# EAGLE design Assam_police (EAGLE 7.2.0)
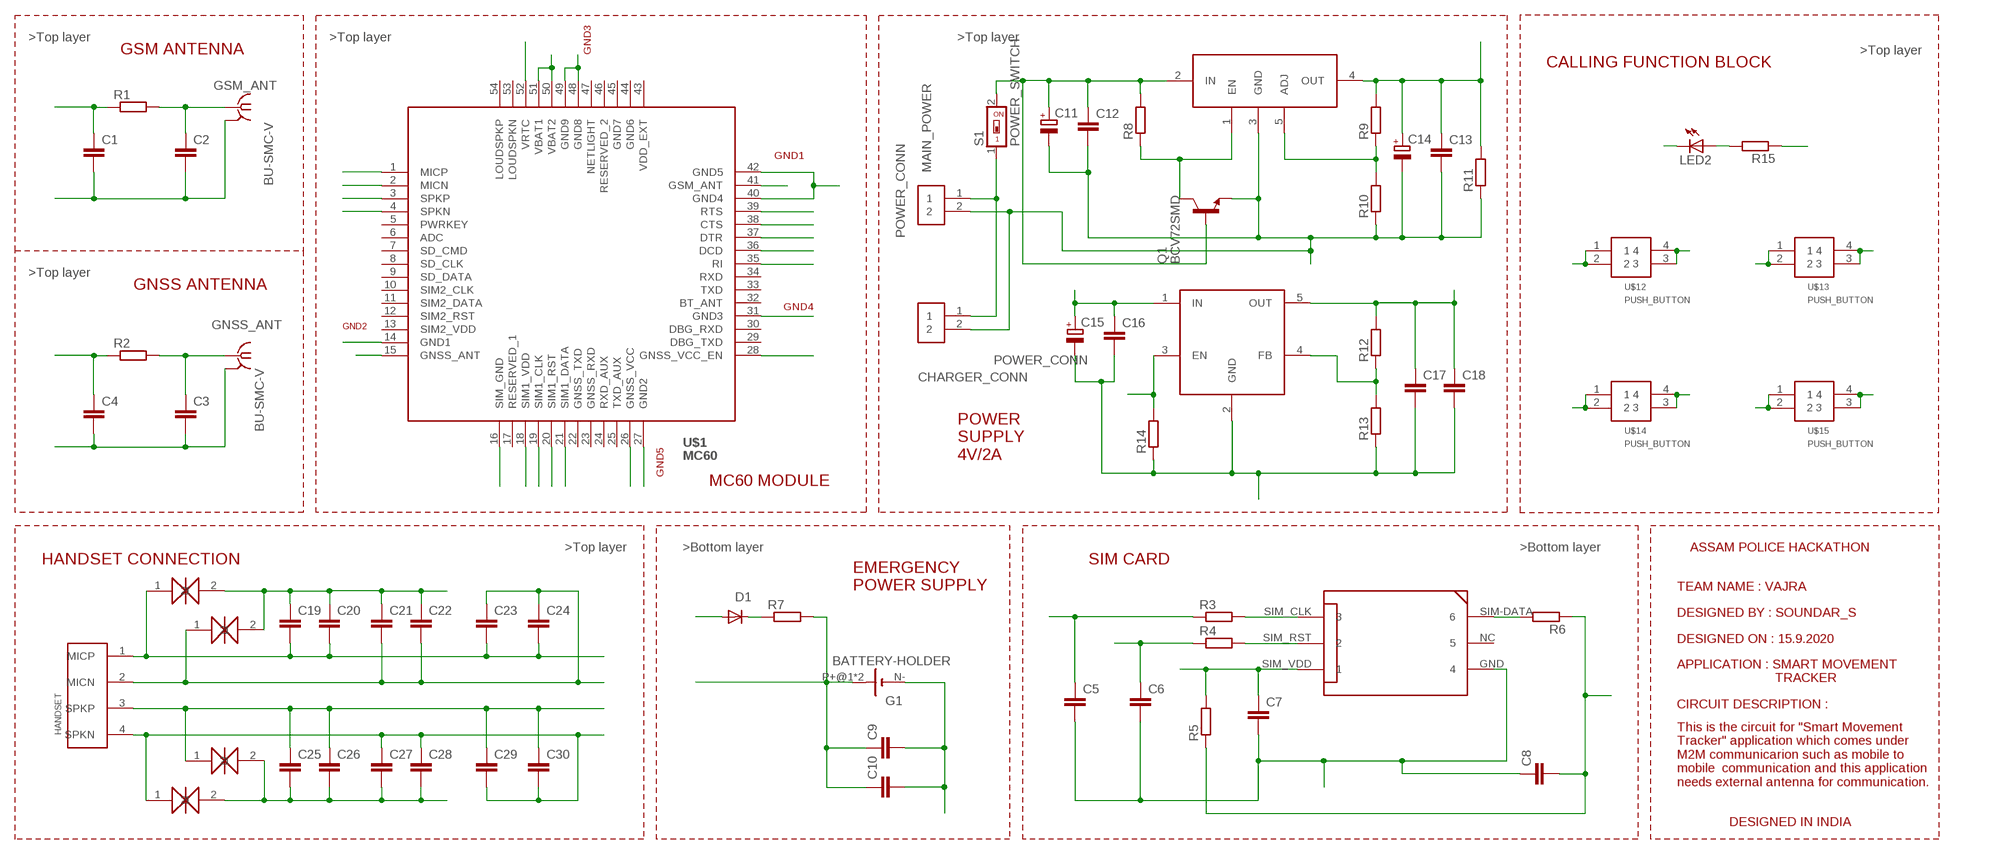
[diagram p0: schematic, sheet 1]

## Parts
C1  C-EUC0603K  [C0603K]
C2  C-EUC0603K  [C0603K]
C3  C-EUC0603K  [C0603K]
C4  C-EUC0603K  [C0603K]
C5  C-EUC0603K  [C0603K]
C6  C-EUC0603K  [C0603K]
C7  C-EUC0603K  [C0603K]
C8  C-EUC0603K  [C0603K]
C9  C-EUC0603K  [C0603K]
C10  C-EUC0603K  [C0603K]
C11  CPOL-EU140CLH-0810  [140CLH-0810]
C12  C-EUC1808  [C1808]
C13  C-EUC1808  [C1808]
C14  CPOL-EU140CLH-0810  [140CLH-0810]
C15  CPOL-EU140CLH-0810  [140CLH-0810]
C16  C-EUC1808  [C1808]
C17  C-EUC1808  [C1808]
C18  C-EUC1808  [C1808]
C19  C-EUC0603K  [C0603K]
C20  C-EUC0603K  [C0603K]
C21  C-EUC0603K  [C0603K]
C22  C-EUC0603K  [C0603K]
C23  C-EUC0603K  [C0603K]
C24  C-EUC0603K  [C0603K]
C25  C-EUC0603K  [C0603K]
C26  C-EUC0603K  [C0603K]
C27  C-EUC0603K  [C0603K]
C28  C-EUC0603K  [C0603K]
C29  C-EUC0603K  [C0603K]
C30  C-EUC0603K  [C0603K]
CHARGER_CONN  POWER_CONN  POWER_PUSH_TYPE_CONN  [POWER_PUSH_TYPE]
D1  CGRM4001-G  [SOD-123_MINI-SMA]
G1  BATTERY-HOLDER  BATTERY-HOLDER_11.6MM  [CELL_RETAINER_11.6MM]
GNSS_ANT  BU-SMC-V  [BU-SMC-V]
GSM_ANT  BU-SMC-V  [BU-SMC-V]
LED2  LEDSMT1206  [1206]
MAIN_POWER  POWER_CONN  POWER_PUSH_TYPE_CONN  [POWER_PUSH_TYPE]
Q1  BCV72SMD  [SOT23-BEC]
R1  R-EU_M3516  [M3516]
R2  R-EU_M3516  [M3516]
R3  R-EU_M3516  [M3516]
R4  R-EU_M3516  [M3516]
R5  R-EU_M3516  [M3516]
R6  R-EU_M3516  [M3516]
R7  R-EU_M3516  [M3516]
R8  R-EU_MELF0207W  [MINI_MELF-0207W]
R9  R-EU_MELF0207W  [MINI_MELF-0207W]
R10  R-EU_MELF0207W  [MINI_MELF-0207W]
R11  R-EU_MELF0207W  [MINI_MELF-0207W]
R12  R-EU_MELF0207W  [MINI_MELF-0207W]
R13  R-EU_MELF0207W  [MINI_MELF-0207W]
R14  R-EU_MELF0207W  [MINI_MELF-0207W]
R15  R-EU_M3516  [M3516]
S1  POWER_SWITCH  SWS001  [SMS-001]
U$1  MC60  [MC60]
U$2  SIM_MODULE  SIM_6_SMD  [SIM_6_SMD]
U$3  MIC29302  [TO-252]
U$4  SGM2019  [SGM2019]
U$5  HANDSET  HANDSET_4_PIN  [HANDSET_4]
U$6  ESD_DIODE  ESD_PRO_DIODE_1  [ESD_PROTECTION_DIODE]
U$7  ESD_DIODE  ESD_PRO_DIODE_1  [ESD_PROTECTION_DIODE]
U$8  ESD_DIODE  ESD_PRO_DIODE_1  [ESD_PROTECTION_DIODE]
U$9  ESD_DIODE  ESD_PRO_DIODE_1  [ESD_PROTECTION_DIODE]
U$12  PUSH_BUTTON  PUSH_BUTTON_4  [PUSH_BUTTON]
U$13  PUSH_BUTTON  PUSH_BUTTON_4  [PUSH_BUTTON]
U$14  PUSH_BUTTON  PUSH_BUTTON_4  [PUSH_BUTTON]
U$15  PUSH_BUTTON  PUSH_BUTTON_4  [PUSH_BUTTON]

## Nets
CALL_CUT0: U$1.37(DTR) U$13.1 U$13.2
CALL_CUT1: U$1.35(RI) U$15.1 U$15.2
CALL_MAKING: U$1.36(DCD) U$14.1 U$14.2
CALL_PICKING: U$1.38(CTS) U$12.1 U$12.2
GND1: C1.2 C2.2 GSM_ANT.2 GSM_ANT.3 GSM_ANT.4 GSM_ANT.5 LED2.C U$1.40(GND4) U$1.42(GND5)
GND2: C3.2 C4.2 C19.1 C20.1 C21.1 C22.1 C25.2 C26.2 C27.2 C28.2 GNSS_ANT.2 GNSS_ANT.3 GNSS_ANT.4 GNSS_ANT.5 U$1.14(GND1) U$6.2 U$7.2 U$8.2 U$9.2
GND3: C9.2 C10.2 C11.- C12.2 C13.2 C14.- CHARGER_CONN.2 G1.N-(-) MAIN_POWER.2 Q1.E R10.1 R11.1 U$1.48(GND8) U$1.49(GND9) U$3.3(GND)
GND4: U$1.31(GND3)
GND5: C15.- C16.2 C17.2 C18.2 R13.1 R14.1 U$1.27(GND2) U$4.2(GND)
GNSS_ANT: C4.1 R2.1 U$1.15(GNSS_ANT)
GNSS_VCC: C17.1 C18.1 R12.2 U$1.26(GNSS_VCC) U$4.5(OUT)
GNSS_VCC_EN: R14.2 U$1.28(GNSS_VCC_EN) U$4.3(EN)
GSM_ANT: C1.1 R1.1 U$1.41(GSM_ANT)
INCOMMING_CALL_INDI: R15.1 U$1.39(RTS)
MICN: C21.2 C22.2 C23.1 C24.1 U$1.2(MICN) U$5.2(MICN) U$7.1
MICP: C19.2 C20.2 C23.2 C24.2 U$1.1(MICP) U$5.1(MICP) U$6.1
N$1: C2.1 GSM_ANT.1 R1.2
N$2: R3.2 U$2.SIM_CLK
N$3: R4.2 U$2.SIM_RST
N$5: C3.1 GNSS_ANT.1 R2.2
N$6: CHARGER_CONN.1 MAIN_POWER.1 S1.1
N$7: D1.C R7.1
N$8: LED2.A R15.2
N$9: R6.2 U$2.SIM-DATA
N$11: R9.1 R10.2 U$3.5(ADJ)
N$12: R12.1 R13.2 U$4.4(FB)
N$17: C11.+ C12.1 Q1.B R8.2 S1.2 U$3.2(IN)
N$21: Q1.C R8.1 U$3.1(EN)
SIM_CLK: C5.1 R3.1 U$1.19(SIM1_CLK)
SIM_DATA: C8.2 R5.1 R6.1 U$1.21(SIM1_DATA)
SIM_GND: C5.2 C6.2 C7.2 C8.1 U$1.16(SIM_GND) U$2.GND
SIM_RST: C6.1 R4.1 U$1.20(SIM1_RST)
SIM_VDD: C7.1 R5.2 U$1.18(SIM1_VDD) U$2.SIM_VDD
SPKN: C27.1 C28.1 C29.2 C30.2 U$1.4(SPKN) U$5.4(SPKN) U$9.1
SPKP: C25.1 C26.1 C29.1 C30.1 U$1.3(SPKP) U$5.3(SPKP) U$8.1
VBAT: C13.1 C14.+ C15.+ C16.1 D1.A R9.2 R11.2 U$1.50(VBAT2) U$1.51(VBAT1) U$3.4(OUT) U$4.1(IN) U$12.3 U$12.4 U$13.3 U$13.4 U$14.3 U$14.4 U$15.3 U$15.4
VRTC: C9.1 C10.1 G1.P+@1(+) G1.P+@2(+) R7.2 U$1.52(VRTC)
Unconnected: U$1.5(PWRKEY) U$1.6(ADC) U$1.7(SD_CMD) U$1.8(SD_CLK) U$1.9(SD_DATA) U$1.10(SIM2_CLK) U$1.11(SIM2_DATA) U$1.12(SIM2_RST) U$1.13(SIM2_VDD) U$1.17(RESERVED_1) U$1.22(GNSS_TXD) U$1.23(GNSS_RXD) U$1.24(RXD_AUX) U$1.25(TXD_AUX) U$1.29(DBG_TXD) U$1.30(DBG_RXD) U$1.32(BT_ANT) U$1.33(TXD) U$1.34(RXD) U$1.43(VDD_EXT) U$1.44(GND6) U$1.45(GND7) U$1.46(RESERVED_2) U$1.47(NETLIGHT) U$1.53(LOUDSPKN) U$1.54(LOUDSPKP) U$2.NC

## Notes on the sheet
- >Top layer | >Top layer | >Top layer
- GSM ANTENNA | GND3 | >Top layer
- CALLING FUNCTION BLOCK
- GND1
- >Top layer
- GNSS ANTENNA
- GND4
- GND2
- GND5
- POWER 
  SUPPLY 
  4V/2A
- MC60 MODULE
- >Top layer | >Bottom layer | >Bottom layer | ASSAM POLICE HACKATHON
- HANDSET CONNECTION | SIM CARD
- EMERGENCY 
  POWER SUPPLY
- TEAM NAME : VAJRA
- DESIGNED BY : SOUNDAR_S
- DESIGNED ON : 15.9.2020
- APPLICATION : SMART MOVEMENT
                              TRACKER
- CIRCUIT DESCRIPTION :
- This is the circuit for "Smart Movement
  Tracker" application which comes under 
  M2M communicarion such as mobile to 
  mobile  communication and this application 
  needs external antenna for communication.
- DESIGNED IN INDIA

## Library data of the parts
C1-C10 C12 C13 C16-C30 = rcl:C-EU: CAPACITOR, European symbol
C11 C14 C15 = rcl:CPOL-EU: POLARIZED CAPACITOR, European symbol
CHARGER_CONN MAIN_POWER = POWER_PUSH_TYPE_CONN:POWER_PUSH_TYPE_CONN
D1 = diode:CGRM400*-G: Molded plasitc,JEDEC SOD-123/Mini SMA Source: Comchip CGRM4001-G.pdf
G1 = battery:BATTERY-HOLDER_11.6MM: 11.6mm PC BUTTON CELL RETAINER, high 5.97mm KEYSTONE ELECTRONICS CORP. Data sheet <http://www.farnell.com/cad/1718310.pdf>; MF: KEYSTONE; MPN: 2997; OC_FARNELL: 2293265
GNSS_ANT GSM_ANT = con-coax:BU-SMC-V: FEMALE SMC CONNECTOR Radiall R112 426 distributor RS 295-5429; OC_FARNELL: unknown; OC_NEWARK: unknown
LED2 = led:LED: LED OSRAM: - CHIPLED LG R971, LG N971, LY N971, LG Q971, LY Q971, LO R971, LY R971 LH N974, LH R974 LS Q976, LO Q976, LY Q976 LO Q996 - Hyper CHIPLED LW Q18S LB Q993, LB Q99A, LB R99A - SideLED LS A670, LO A670, LY A670, LG A670, LP A670 LB A673, LV A673, LT A673, LW A673 LH A674 LY A675 LS A676, LA A676, LO A676, LY A676, LW A676 LS A679, LY A679, LG A679 - Hyper Micro SIDELED® LS Y876, LA Y876, LO Y876, LY Y876 LT Y87S - SmartLED LW L88C, LW L88S LB L89C, LB L89S, LG L890 LS L89K, LO L89K, LY L89K LS L896, LA L896, LO L896, LY L896 - TOPLED LS T670, LO T670, LY T670, LG T670, LP T670 LSG T670, LSP T670, LSY T670, LOP T670, LYG T670 LG T671, LOG T671, LSG T671 LB T673, LV T673, LT T673, LW T673 LH T674 LS T676, LA T676, LO T676, LY T676, LB T676, LH T676, LSB T676, LW T676 LB T67C, LV T67C, LT T67C, LS T67K, LO T67K, LY T67K, LW E67C LS E67B, LA E67B, LO E67B, LY E67B, LB E67C, LV E67C, LT E67C LW T67C LS T679, LY T679, LG T679 LS T770, LO T770, LY T770, LG T770, LP T770 LB T773, LV T773, LT T773, LW T773 LH T774 LS E675, LA E675, LY E675, LS T675 LS T776, LA T776, LO T776, LY T776, LB T776 LHGB T686 LT T68C, LB T68C - Hyper Mini TOPLED® LB M676 - Mini TOPLED Santana® LG M470 LS M47K, LO M47K, LY M47K Source: http://www.osram.convergy.de LUXEON: - LUMILED® LXK2-PW12-R00, LXK2-PW12-S00, LXK2-PW14-U00, LXK2-PW14-V00 LXK2-PM12-R00, LXK2-PM12-S00, LXK2-PM14-U00 LXK2-PE12-Q00, LXK2-PE12-R00, LXK2-PE12-S00, LXK2-PE14-T00, LXK2-PE14-U00 LXK2-PB12-K00, LXK2-PB12-L00, LXK2-PB12-M00, LXK2-PB14-N00, LXK2-PB14-P00, LXK2-PB14-Q00 LXK2-PR12-L00, LXK2-PR12-M00, LXK2-PR14-Q00, LXK2-PR14-R00 LXK2-PD12-Q00, LXK2-PD12-R00, LXK2-PD12-S00 LXK2-PH12-R00, LXK2-PH12-S00 LXK2-PL12-P00, LXK2-PL12-Q00, LXK2-PL12-R00 Source: www.luxeon.com KINGBRIGHT: KA-3528ASYC Source: www.kingbright.com
Q1 = transistor-npn:BCV72*: NPN Transistor
R1-R15 = rcl:R-EU_: RESISTOR, European symbol
S1 = smd-special:SWS001: SMD Dip Switch 1 pol.
U$1 = MC60_2.0_GSM_Dev:MC60: MC60 is a multi-purpose module which integrates a high performance GNSS engine and a quad-band GSM/GPRS engine.
U$2 = SIM_SMD:SIM_6_SMD: THIS PACKAGE CONTAINS 6 PINS.
U$3 = MIC29302:MIC29302: MIC29300/29301/29302/29303: 3A The MIC2915x/2930x/2950x/2975x are fully protected against overcurrent faults, reversed input polarity, reversed lead insertion, overtemperature operation, and positive and negative transient voltage spikes high current, high accuracy, low dropout voltage regulators. Using Microchip’s proprietary Super βeta PNP process with a PNP pass element, these regulators feature 350 mV to 425 mV (full load) typical dropout voltages and very low ground current. Designed for high current loads, these devices also find applications in lower current, extremely low dropout-critical systems, where their tiny dropout voltage and ground current values are important attributes.
U$4 = SGM2019:SGM2019
U$5 = Handset_4pin:HANDSET_4_PIN
U$6-U$9 = ESD_PROTECTION_DIODE:ESD_PRO_DIODE_1
U$12-U$15 = PUSH_BUTTON_4_PIN:PUSH_BUTTON_4

## Board
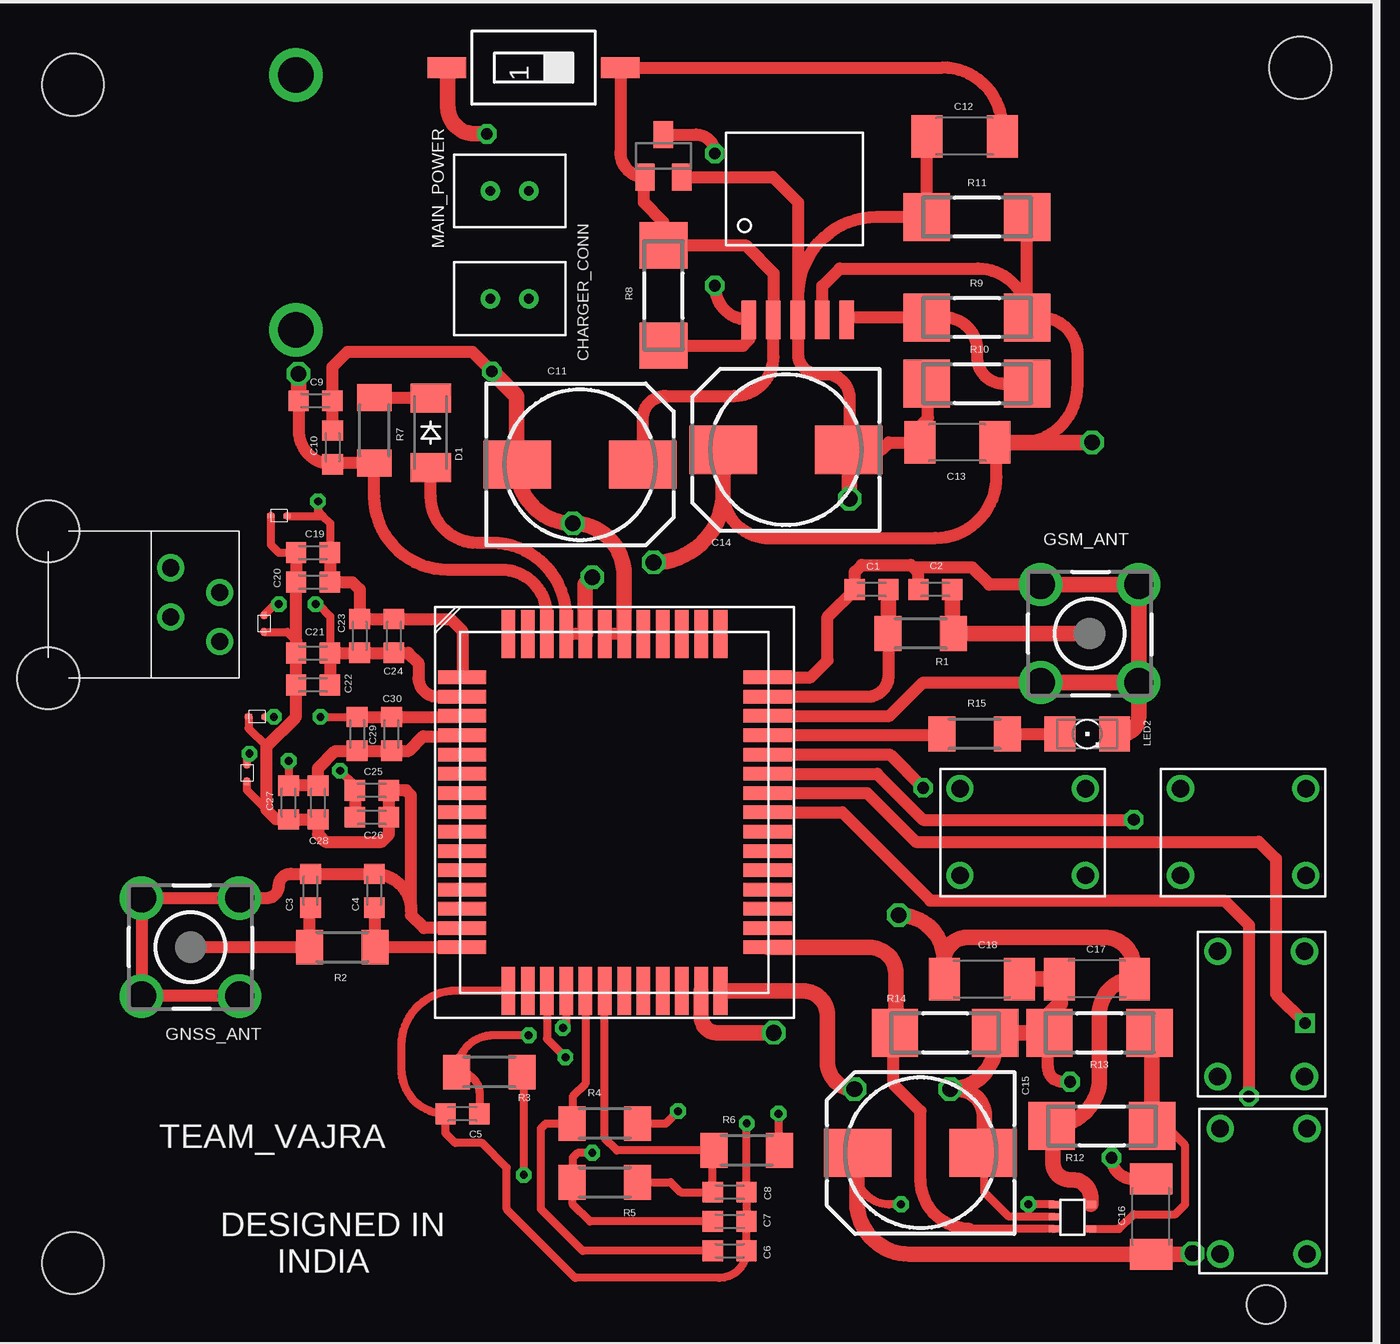
[diagram p1: board, top side]
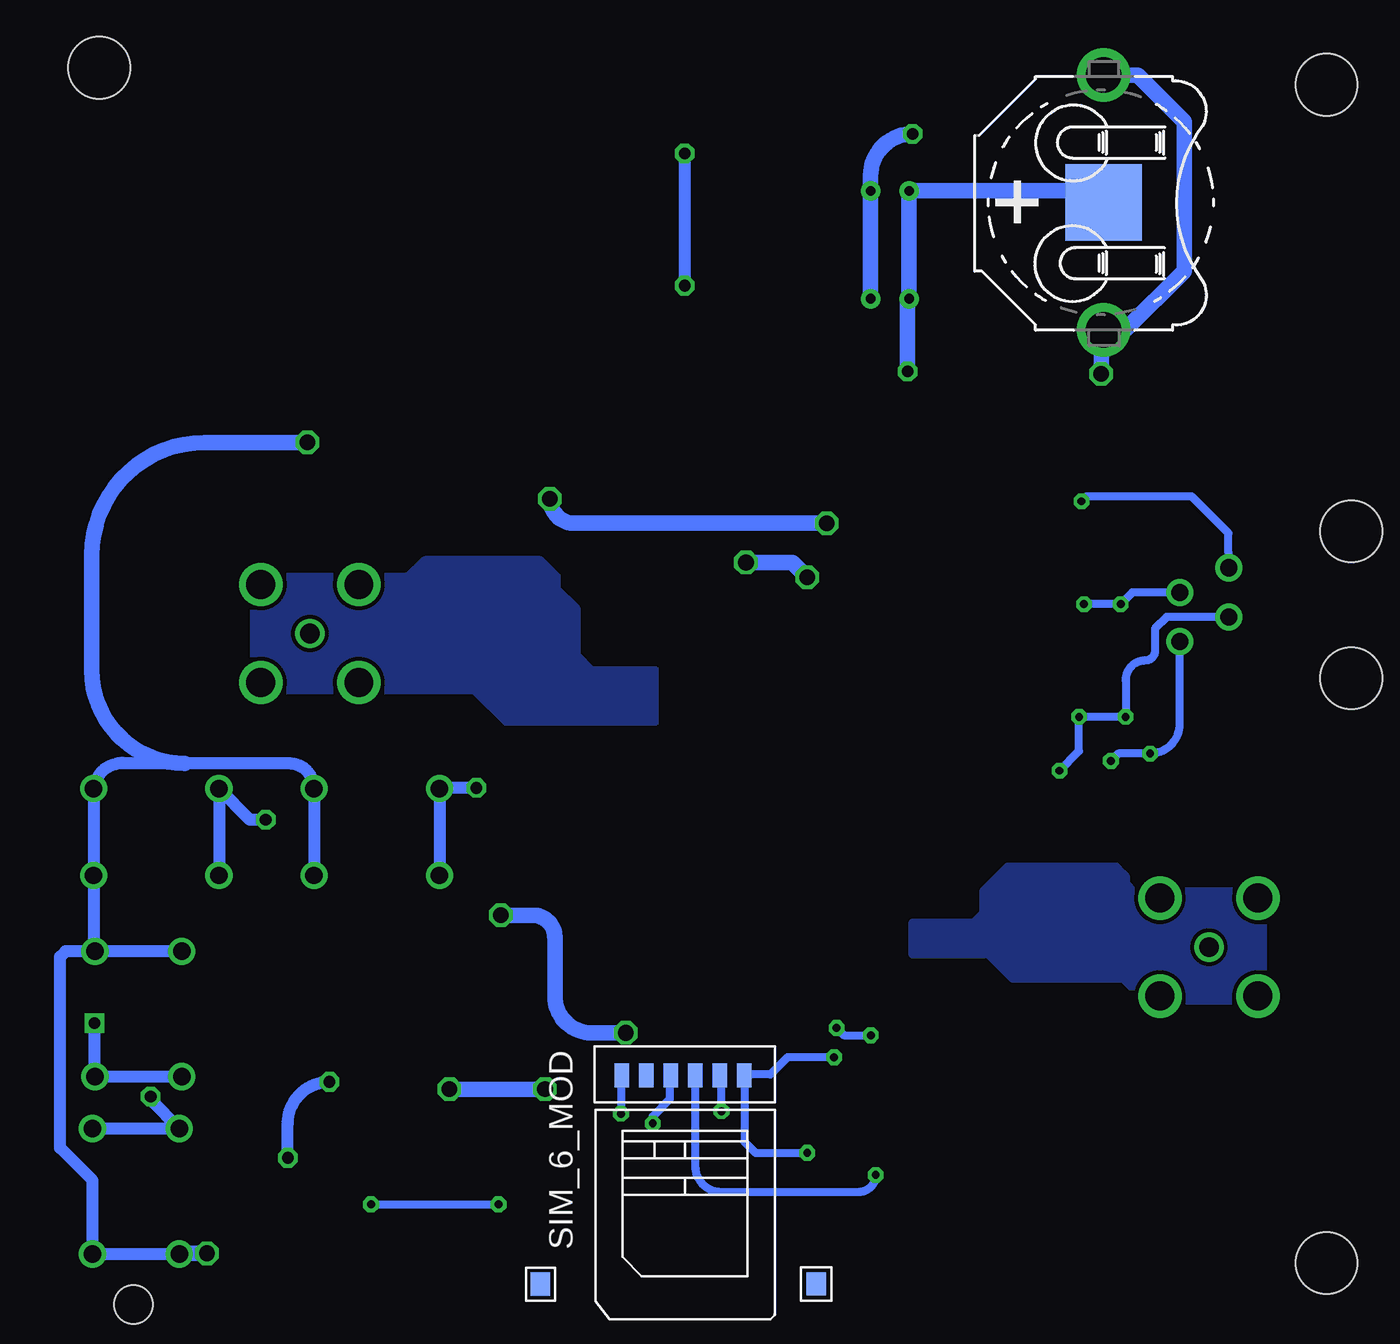
[diagram p2: board, bottom side, seen from below]

No outline drawn. Coordinates in mm, seen from the top.
Copper layers (1*16): Top 0.035mm / dielectric 1.5mm / Bottom 0.035mm
Design rules "default": minimum track width 10mil, minimum drill 24mil, track to track 8mil, track to pad 8mil, pad to pad 8mil, via to via 8mil, smd to smd 8mil, copper to edge 40mil, drill to drill 8mil, minimum pad ring 10mil, minimum via ring 8mil, stop-mask expansion 4mil, vias tented up to drill 0mil, thermal gap 10mil
Holes 3.2 mm at 74.55,39.75 74.55,100.84 138.18,101.73
Holes 2 mm at 136.4,37.59

### Footprints (pad centres in the part's own frame; a part is rotated, then mirrored left to right if it is on the bottom)
C0603K = smd 1.05 x 1.08: 1 -0.875,0; 2 0.875,0
140CLH-0810 = smd 3.5 x 2.5: + 3.25,0; - -3.25,0
C1808 = smd 1.6 x 2.2: 1 -1.95,0; 2 1.95,0
POWER_PUSH_TYPE = drill 0.5: 1 -1.03,0.04; 2 0.97,0.04
SOD-123_MINI-SMA = smd 1.5 x 2.1: A 1.8,0; C -1.8,0
CELL_RETAINER_11.6MM = smd 3.96 x 3.96: N- 0,0 | drill 1.85 pad 2.54: P+@1 -6.605,0; P+@2 6.605,0
BU-SMC-V = drill 1.016: 1 0,0 | drill 1.5: 2 -2.54,2.54; 3 2.54,2.54; 4 2.54,-2.54; 5 -2.54,-2.54
1206 = smd 1.6 x 1.803: A -1.422,0; C 1.422,0
SOT23-BEC = smd 1 x 1.4: B -0.95,-1.1; C 0,1.1; E 0.95,-1.1
M3516 = smd 1.4 x 1.8: 1 -1.7,0; 2 1.7,0
MINI_MELF-0207W = smd 2.4 x 2.5: 1 -2.6,0; 2 2.6,0
SMS-001 = smd 1.092 x 2.007: 1 0,-4.496; 2 0,4.496
MC60 = smd 2.5 x 0.7: 1 -7.9,7; 2 -7.9,6; 3 -7.9,5; 4 -7.9,4; 5 -7.9,3; 6 -7.9,2; 7 -7.9,1; 8 -7.9,0; 9 -7.9,-1; 10 -7.9,-2; 11 -7.9,-3; 12 -7.9,-4; 13 -7.9,-5; 14 -7.9,-6; 15 -7.9,-7; 28 7.95,-7; 29 7.95,-6; 30 7.95,-5; 31 7.95,-4; 32 7.95,-3; 33 7.95,-2; 34 7.95,-1; 35 7.95,0; 36 7.95,1; 37 7.95,2; 38 7.95,3; 39 7.95,4; 40 7.95,5; 41 7.95,6; 42 7.95,7 | smd 0.7 x 2.5: 16 -5.5,-9.25; 17 -4.5,-9.25; 18 -3.5,-9.25; 19 -2.5,-9.25; 20 -1.5,-9.25; 21 -0.5,-9.25; 22 0.5,-9.25; 23 1.5,-9.25; 24 2.5,-9.25; 25 3.5,-9.25; 26 4.5,-9.25; 27 5.5,-9.25; 43 5.5,9.25; 44 4.5,9.25; 45 3.5,9.25; 46 2.5,9.25; 47 1.5,9.25; 48 0.5,9.25; 49 -0.5,9.25; 50 -1.5,9.25; 51 -2.5,9.25; 52 -3.5,9.25; 53 -4.5,9.25; 54 -5.5,9.25
SIM_6_SMD = smd 0.75 x 1.25: GND 0.71,-5.67; NC 1.98,-5.67; SIM-DATA 3.25,-5.67; SIM_CLK -0.56,-5.67; SIM_RST -1.83,-5.67; SIM_VDD -3.1,-5.67 | smd 1 x 1.2: P$7 -6.82,5.14; P$8 7.48,5.15
TO-252 = smd 0.76 x 2: 1 -2.43,-6.85; 2 -1.16,-6.85; 3 0.11,-6.85; 4 1.38,-6.85; 5 2.65,-6.86
SGM2019 = smd 0.53 x 0.37: 1 -0.97,0.625; 2 -0.97,-0.005; 3 -0.97,-0.635; 4 0.95,-0.635; 5 0.95,0.625
HANDSET_4 = drill 0.9: 1 -2.01,1.89; 2 -0.73,4.43; 3 0.54,1.89; 4 1.81,4.43 | hole 3.2: -3.91,-4.46; 3.71,-4.46
ESD_PROTECTION_DIODE = smd 0.36 x 0.25: 1 -0.44,0; 2 0.42,-0.01
PUSH_BUTTON = drill 0.9: 1 -3.67,2.63; 2 -3.67,-1.87; 3 2.83,-1.87; 4 2.83,2.63

### Placement (x,y rotation side)
C1  115.95,74.68 180 top
C2  119.25,74.68 180 top
C3  86.87,59.05 90 top
C4  90.17,59.05 90 top
C5  94.74,47.5 180 top
C6  108.58,40.39 0 top
C7  108.58,41.91 0 top
C8  108.58,43.43 180 top
C9  87.12,84.45 0 top
C10  88.01,82.04 90 top
C11  100.84,81.15 0 top
C12  120.78,98.17 180 top
C13  120.4,82.3 180 top
C14  111.51,81.92 180 top
C15  118.49,45.47 180 top
C16  130.43,42.16 90 top
C17  127.64,54.48 180 top
C18  121.67,54.48 0 top
C19  87,76.58 0 top
C20  87,75.06 0 top
C21  87,71.37 0 top
C22  87,69.72 0 top
C23  89.41,72.26 90 top
C24  91.19,72.26 90 top
C25  90.04,64.26 0 top
C26  90.04,62.87 0 top
C27  85.72,63.63 270 top
C28  87.25,63.63 270 top
C29  89.28,67.18 270 top
C30  91.06,67.18 270 top
CHARGER_CONN  97.16,89.79 180 top
D1  93.09,82.8 270 top
G1  86.11,94.74 270 bottom
GNSS_ANT  80.64,56.13 270 top
GSM_ANT  127.25,72.39 270 top
LED2  127.13,67.18 0 top
MAIN_POWER  97.16,95.38 180 top
Q1  105.16,97.16 0 top
R1  118.49,72.39 0 top
R2  88.52,56.13 180 top
R3  96.14,49.66 0 top
R4  102.11,46.99 0 top
R5  102.11,43.94 180 top
R6  109.47,45.59 0 top
R7  90.17,82.93 270 top
R8  105.16,89.92 90 top
R9  121.41,88.77 0 top
R10  121.41,85.34 0 top
R11  121.41,93.98 0 top
R12  127.89,46.86 180 top
R13  127.76,51.69 0 top
R14  119.76,51.69 180 top
R15  121.28,67.18 0 top
S1  98.42,101.73 270 top
U$1  102.62,63.12 0 top
U$2  107.82,43.81 180 bottom
U$3  112.01,95.5 0 top
U$4  126.36,42.16 0 top
U$5  77.72,73.79 270 top
U$6  85.22,78.49 180 top
U$7  84.45,72.9 270 top
U$8  84.07,68.07 180 top
U$9  83.57,65.15 270 top
U$12  124.21,61.72 0 top
U$13  135.64,61.72 0 top
U$14  136.53,53.09 90 top
U$15  135.89,43.05 270 top

### Tracks (layer width: path | path; a pad name or v marks a point on that pad's centre or on a via)
CALL_CUT0  (via drill 0.61)
  Top 0.61: U$1.37 116.24,65.12 118.62,62.74 v129.54,62.74
  Bottom 0.61: U$13.2 U$13.1 130.35,62.74 v129.54,62.74
CALL_CUT1  (via drill 0.61)
  Top 0.61: U$1.35 114.43,63.12 119,58.55 134.24,58.55 135.51,57.28 v135.51,48.39
  Bottom 0.61: U$15.1 U$15.2 135.51,48.21 v135.51,48.39
CALL_MAKING  (via drill 0.6)
  Top 0.61: U$1.36 115.71,64.12 118.24,61.59 136.02,61.59 136.91,60.71 136.91,53.72 v138.43,52.2
  Bottom 0.61: U$14.1 U$14.2 138.43,49.45 v138.43,52.2
CALL_PICKING  (via drill 0.61)
  Top 0.61: U$1.38 116.89,66.12 v118.62,64.39
  Bottom 0.61: U$12.2 U$12.1 120.5,64.39 v118.62,64.39
GND
  pour Bottom: 96.01,57.4 92.84,57.4 92.33,57.91 92.33,59.05 91.69,59.69 91.19,60.2 91.06,60.33 85.47,60.33 85.34,60.2 84.96,59.82 84.96,59.44 84.58,59.05 78.11,59.05 77.85,58.8 77.85,53.47 77.98,53.34 83.44,53.34 83.95,53.34 85.09,54.48 90.81,54.48 92.08,55.75 95.89,55.75 96.01,55.75
  pour Bottom: 109.35,70.48 112.65,70.48 113.41,71.25 113.41,73.66 113.54,73.79 114.43,74.68 114.43,75.31 115.32,76.2 121.28,76.2 122.17,75.31 130.05,75.31 130.18,75.18 130.18,69.47 118.75,69.47 118.62,69.34 117.09,67.82 109.35,67.82
GND1
  Top 0.61: 118.11,75.82 118.36,75.56 118.36,74.69 C2.2 | GSM_ANT.5 122.05,74.93 121.16,75.82 118.11,75.82 | 118.11,75.82 117.98,75.95 115.44,75.95 115.08,75.58 C1.2 113.67,73.27 113.67,70.99 112.79,70.12 U$1.42 | U$1.40 116.89,68.12 118.62,69.85 GSM_ANT.4
  Top 0.813: GSM_ANT.4 GSM_ANT.3 | GSM_ANT.3 GSM_ANT.2 GSM_ANT.5 | LED2.C 128.91,67.18 arc90 129.79,68.07 GSM_ANT.3
GND2
  Top 0.406: U$6.2 84.8,77 85.22,76.58 C19.1 | U$7.2 85.65,72.48 86.12,72.01 | U$8.2 83.65,67.48 84.58,66.55 | U$9.2 83.56,64.27 84.58,63.25
  Top 0.61: U$1.14 92.74,57.12 92.08,57.78 92.08,58.02 | 92.08,58.02 92.08,64.01 91.82,64.26 C25.2 C26.2 90.93,62.85 90.93,61.98 90.55,61.59 87.63,61.59 87.25,61.98 C28.2 C27.2 85.08,62.75 84.58,63.25 84.58,66.55 86.11,68.07 86.11,69.71 C22.1 C21.1 86.12,72.01 C20.1 C19.1 | GNSS_ANT.3 GNSS_ANT.4 GNSS_ANT.5 GNSS_ANT.2 84.58,58.67 arc90 85.22,59.31 arc-90 85.84,59.93 C3.2 C4.2 arc-90 92.08,58.02
GND3  (via drill 0.6, 0.81)
  Top 0.61: R10.1 118.87,85.28 118.87,83.57 118.45,83.14 C13.2 116.84,82.3 116.46,81.92 C14.- arc90 114.81,81.97 114.81,84.58 arc90 113.54,85.85 113.16,85.85 arc-90 112.14,86.87 112.14,88.67 | Q1.E 110.83,96.06 112.14,94.74 112.14,89.92 | 112.14,89.92 112.14,88.67 | 112.14,88.67 U$3.3 | 112.14,89.92 arc-90 116.2,93.98 R11.1 118.81,98.16 arc-90 C12.2 | U$1.48 U$1.49 | C10.2 C9.2 88,86.22 88.77,87 95.25,87 v96.27,85.98
  Top 0.813: v114.81,79.38 114.81,81.86 arc90 C14.- | v96.27,85.98 97.54,84.71 97.54,81.2 C11.- 97.59,80.97 arc90 v100.46,78.11 arc-90 103.12,75.45 U$1.48
  Bottom 0.813: v100.46,78.11 113.54,78.11 arc90 v114.81,79.38 | v96.27,85.98 96.27,89.67 CHARGER_CONN.2 MAIN_POWER.2 86.7,95.34 G1.N-
GND5  (via drill 0.61, 0.81)
  Top 0.406: U$4.2 123.07,42.16 121.79,43.43 121.79,45.41 C15.-
  Top 0.61: C16.2 129.5,44.11 arc-90 v128.4,45.21 | v126.24,49.15 125.86,49.15 arc-90 125.09,49.91 125.09,51.62 arc-90 R13.1
  Top 0.813: C18.2 C17.2 125.73,54.44 125.73,53.21 125.16,52.65 R13.1 R14.1 122.36,51.11 arc-90 v120.02,48.77 120.4,48.77 arc-90 121.79,47.37 121.79,45.52 arc-90 C15.- | U$1.27 112.37,53.87 arc-90 113.67,52.58 113.67,50.16 arc90 v115.06,48.77
  Bottom 0.61: v128.4,45.21 128.4,46.99 arc90 v126.24,49.15
  Bottom 0.813: v115.06,48.77 v120.02,48.77
GNSS_ANT
  Top 0.61: C4.1 arc-90 90.22,58.13 R2.1 arc90 90.23,56.12 U$1.15
GNSS_VCC  (via drill 0.81)
  Top 0.813: R12.2 arc90 127.76,49.34 127.76,52.66 arc-90 C17.1 arc-90 129.54,54.53 129.54,55.12 arc90 128.02,56.64 120.9,56.64 arc90 119.72,55.45 | 125.35,46.8 R12.2 | U$4.5 127.31,43.12 arc90 126.36,44.07 126.24,44.07 arc-90 125.35,44.96 125.35,46.8 | 125.35,46.8 arc90 R12.2 | C18.1 119.72,55.45 | U$1.26 107.12,52.52 arc90 107.95,51.69 v110.87,51.69 | v117.35,57.78 117.39,57.78 arc-90 119.72,55.45
  Bottom 0.813: v110.87,51.69 112.65,51.69 arc90 114.55,53.59 114.55,56.64 arc-90 115.7,57.78 v117.35,57.78
GNSS_VCC_EN
  Top 0.406: U$4.3 121.03,41.53 | 117.09,51.62 R14.2
  Top 0.61: 121.03,41.53 arc-90 118.49,44.07 118.49,47.62 117.09,49.02 117.09,51.62
  Top 0.813: R14.2 arc90 117.22,51.75 117.22,54.74 arc90 115.84,56.12 U$1.28
GSM_ANT
  Top 0.61: U$1.41 115.73,69.12 arc90 116.84,70.23 116.84,72.34
  Top 0.813: 116.76,72.42 arc-90 R1.1 | R1.1 arc90 116.84,72.44 arc-90 116.83,72.45 C1.1 | 116.84,72.34 arc90 R1.1
INCOMMING_CALL_INDI
  Top 0.61: U$1.39 119.52,67.12 R15.1
MICN  (via drill 0.41)
  Top 0.406: U$7.1 85.03,73.91 v85.22,73.91 | v87.12,73.91 87.25,73.91 87.88,73.28 87.88,71.39 C21.2
  Top 0.61: C22.2 C21.2 89.39,71.37 C23.1 C24.1 91.93,71.39 92.46,70.87 92.46,70.1 arc90 93.44,69.12 U$1.2 94.69,69.09
  Bottom 0.406: v87.12,73.91 v85.22,73.91 84.61,74.52 U$5.2
MICP  (via drill 0.41)
  Top 0.406: U$6.1 87.5,78.49 | 87.5,78.49 87.88,78.11 87.88,76.59 C19.2 | v87.25,79.25 87.25,78.74 87.5,78.49
  Top 0.61: C19.2 87.87,76.47 87.88,76.45 87.88,75.07 C20.2 89.03,75.06 89.41,74.68 C23.2 C24.2 94.12,73.14 94.74,72.52 94.74,70.14 U$1.1
  Bottom 0.406: U$5.1 79.61,76.57 79.63,76.58 79.63,77.6 81.53,79.5 87,79.5 v87.25,79.25
N$1
  Top 0.813: GSM_ANT.1 R1.2 arc-90 120.14,72.44 arc-90 120.13,72.45 C2.1
N$2  (via drill 0.41)
  Top 0.406: R3.2 arc-90 97.92,49.58 v97.92,44.32
  Bottom 0.406: v97.92,44.32 arc90 98.81,43.43 105.92,43.43 arc90 107.26,44.78 U$2.SIM_CLK
N$3  (via drill 0.41)
  Top 0.406: R4.2 105.28,46.99 v105.92,47.62
  Bottom 0.406: v105.92,47.62 105.92,49.41 U$2.SIM_RST
N$5
  Top 0.61: GNSS_ANT.1 R2.2 86.82,58.13 arc-90 C3.1
N$6  (via drill 0.6)
  Top 0.813: v96.01,98.3 95.38,98.3 arc-90 93.98,99.69 93.98,101.68 arc90 S1.1
  Bottom 0.813: CHARGER_CONN.1 MAIN_POWER.1 98.19,96.12 arc90 v96.01,98.3
N$7
  Top 0.61: D1.C 90.2,84.6 arc-90 R7.1
N$8
  Top 0.61: R15.2 LED2.A
N$9  (via drill 0.41)
  Top 0.406: v111.12,47.5 111.12,45.64 R6.2
  Bottom 0.406: U$2.SIM-DATA 111.12,49.48 v111.12,47.5
N$11
  Top 0.61: U$3.5 114.79,88.77 R9.1 119.76,88.77 arc-90 121.41,87.12 121.41,86.74 arc90 122.81,85.34 R10.2
N$12
  Top 0.406: U$4.4 128.78,41.53 129.54,42.29 131.7,42.29 132.21,42.8 132.21,45.85 131.19,46.86 R12.1
  Top 0.813: R12.1 130.49,51.56 arc90 R13.2
N$17
  Top 0.61: U$3.2 110.87,88.67 110.87,91.06 109.41,92.52 R8.2 105.16,93.73 104.14,94.74 104.14,95.99 Q1.B | 104.16,96.01 Q1.B | 110.87,88.64 U$3.2 | C12.1 122.73,98.63 arc90 119.63,101.73 S1.2 102.92,97.34 arc90 Q1.B | C11.+ 104.09,83.51 arc-90 105.28,84.71 108.84,84.71 arc90 110.87,86.74 110.87,88.64 | 110.87,88.64 arc90 U$3.2
N$21  (via drill 0.61)
  Top 0.61: Q1.C 106.85,98.25 arc-90 v107.82,97.28 | v107.82,90.42 v107.82,90.42 arc90 U$3.1 109.6,88.64 109.6,87.63 109.29,87.32 R8.1
  Bottom 0.61: v107.82,97.28 v107.82,90.42
SIM_CLK  (via drill 0.41)
  Top 0.406: C5.1 arc90 95.63,47.51 95.63,48.51 arc90 94.49,49.66 R3.1 arc-90 96.34,51.56 v98.17,51.56 | U$1.19 100.12,52.11 v99.95,51.94
  Bottom 0.406: v99.95,51.94 99.57,51.56 v98.17,51.56
SIM_DATA
  Top 0.406: U$1.21 102.11,53.86 102.11,46.23 102.74,45.59 R6.1 107.71,45.53 C8.2 106.05,43.43 105.54,43.94 R5.1
SIM_GND  (via drill 0.41)
  Top 0.406: U$1.16 94.38,53.87 arc90 91.57,51.05 91.57,49.8 arc90 C5.2 93.85,47.48 93.85,46.48 94.36,45.97 95.76,45.97 97.03,44.7 97.03,42.55 100.58,38.99 108.06,38.99 arc90 C6.2 C7.2 109.47,41.92 109.47,43.31 109.46,43.32 C8.1 109.46,46.98 v109.47,46.99
  Bottom 0.406: v109.47,46.99 109.47,47.37 108.58,48.26 108.58,49.43 U$2.GND
SIM_RST
  Top 0.406: C6.1 100.97,40.39 98.81,42.55 98.81,46.74 99.06,46.99 R4.1 100.46,47.04 100.46,48.39 101.12,49.05 U$1.20
SIM_VDD  (via drill 0.41)
  Top 0.406: C7.1 101.35,41.91 100.46,42.8 100.46,43.89 R5.2 100.46,43.99 100.46,45.21 100.71,45.47 v101.47,45.47 | U$1.18 99.12,51.38 v100.08,50.42
  Bottom 0.406: v101.47,45.47 104.14,45.47 104.72,46.05 U$2.SIM_VDD 104.68,49.53 103.38,49.53 102.49,50.42 v100.08,50.42
SPKN  (via drill 0.41)
  Top 0.406: U$9.1 83.57,66.04 v83.69,66.17 | v85.72,65.79 C27.1
  Top 0.61: C27.1 C28.1 87.25,65.41 88.14,66.29 89.27,66.29 C29.2 C30.2 91.96,66.31 92.71,67.06 94.65,67.06 U$1.4
  Bottom 0.406: v85.72,65.79 85.34,66.17 v83.69,66.17 arc-90 82.17,67.69 82.17,71.96 arc90 U$5.4
SPKP  (via drill 0.41)
  Top 0.406: U$8.1 v84.96,68.07 | v87.38,68.07 89.27,68.07 C29.1 | C25.1 89.17,64.5 v88.39,65.28
  Top 0.61: C29.1 C30.1 94.66,68.06 U$1.3 | C25.1 C26.1
  Bottom 0.406: v88.39,65.28 87.38,66.29 v87.38,68.07 v84.96,68.07 84.96,69.98 arc90 83.95,70.99 arc-90 83.44,71.5 83.44,72.64 82.84,73.25 U$5.3
VBAT  (via drill 0.41, 0.81)
  Top 0.406: U$4.1 v124.09,42.79 v124.08,42.8 | v117.47,42.8 116.84,42.8 arc-90 115.19,44.45
  Top 0.61: 124.14,88.65 R9.2 | U$3.4 113.39,90.41 114.3,91.31 121.47,91.31 arc-90 R9.2 | R9.2 R11.2 | U$1.50 U$1.51 100.12,73.24 arc90 96.27,77.09 95.5,77.09 arc-90 93.09,79.5 D1.A | C14.+ 108.26,79.7 arc90 110.62,77.34 119.25,77.34 arc90 122.43,80.52 122.43,82.21 arc90 C13.1 123.7,82.3 arc90 126.62,85.22 126.62,86.87 arc90 124.71,88.77 R9.2
  Top 0.813: U$1.50 101.09,72.39 101.09,74.93 v101.47,75.31 | v104.65,76.07 arc90 108.26,79.68 C14.+ | C15.+ arc90 115.19,45.41 115.19,44.45 115.19,42.93 arc90 117.9,40.21 C16.1 132.54,40.21 arc90 v132.59,40.26 | v127.38,82.3 C13.1
  Bottom 0.406: v124.08,42.8 v117.47,42.8 | 138.47,55.99 arc-90 U$14.3
  Bottom 0.61: U$12.3 U$12.4 arc-90 128.34,65.66 133.73,65.66 136.78,65.66 arc-90 U$13.4 U$13.3 138.47,55.99 | U$14.3 U$14.4 139.92,55.92 140.21,55.63 140.21,45.72 138.52,44.03 U$15.4 U$15.3
  Bottom 0.813: v101.47,75.31 102.23,76.07 v104.65,76.07 | U$15.3 arc90 133.98,40.26 v132.59,40.26 | 133.73,65.66 arc90 138.56,70.48 138.56,76.45 arc90 132.72,82.3 v127.38,82.3
VRTC  (via drill 0.81)
  Top 0.61: C9.1 86.25,82.93 arc90 C10.1 arc-90 88.08,81.23 R7.2 90.17,79.5 arc90 93.98,75.69 96.77,75.69 arc-90 99.12,73.35 U$1.52
  Top 0.813: C9.1 86.25,85.84 v86.23,85.85
  Bottom 0.813: G1.P+@1 84.33,101.35 81.92,98.93 81.92,91.19 84.96,88.14 G1.P+@2 86.23,88.01 v86.23,85.85

### Text on the board
tPlace: DESIGNED IN / INDIA
tNames: TEAM_VAJRA